# Altium schematic sheet RS485.SchDoc
size A; SheetNumber: 10; SheetTotal: 13
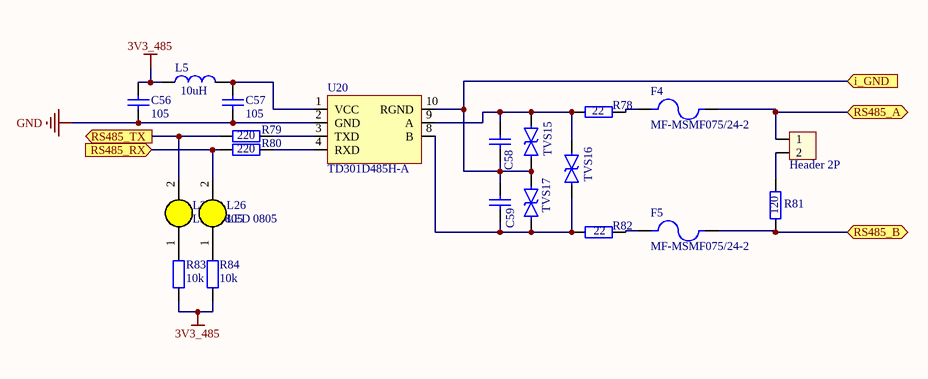
[diagram p0: RS485.SchDoc]

## Parts
C56  105  [0603_Cap]
C57  105  [0603_Cap]
C58  101  [0603_Cap]  (value not drawn)
C59  101  [0603_Cap]  (value not drawn)
F4  MF-MSMF075/24-2  [FUSER_MF-MSMF075/24-2]
F5  MF-MSMF075/24-2  [FUSER_MF-MSMF075/24-2]
H24  Header 2P  [JP 1x2]
L5  10uH  [0603_Inductor]
L25  LED 0805  [LED-0805-Yellow]
L26  LED 0805  [LED-0805-Yellow]
R78  22  [0603_Res]
R79  220  [0603_Res]
R80  220  [0603_Res]
R81  120  [0603_Res]
R82  22  [0603_Res]
R83  10k  [0603_Res]
R84  10k  [0603_Res]
TVS15  SMBJ12CA  [SMB - DO-214AA]  (value not drawn)
TVS16  SMBJ12CA  [SMB - DO-214AA]  (value not drawn)
TVS17  SMBJ12CA  [SMB - DO-214AA]  (value not drawn)
U20  TD301D485H-A  [TD301D485H-A]

## Ports
i_GND (in), RS485_A (bidir), RS485_B (bidir), RS485_RX (in), RS485_TX (out)

## Nets
3V3_485: C56.1 L5.1 R83.2 R84.2
GND: C56.2 C57.2 U20.2(GND)
i_GND: C58.2 C59.1 TVS15.1 TVS17.2 U20.10(RGND) ; port i_GND
RS485_A: F4.2 H24.1 ; port RS485_A
RS485_B: F5.2 R81.2 ; port RS485_B
RS485_RX: L26.2(K) R80.1 ; port RS485_RX
RS485_TX: L25.2(K) R79.1 ; port RS485_TX
NetC57_1: C57.1 L5.2 U20.1(VCC)
NetC58_1: C58.1 R78.2 TVS15.2 TVS16.2 U20.9(A)
NetC59_2: C59.2 R82.2 TVS16.1 TVS17.1 U20.8(B)
NetF4_1: F4.1 R78.1
NetF5_1: F5.1 R82.1
NetH24_2: H24.2 R81.1
NetL25_1: L25.1(A) R83.1
NetL26_1: L26.1(A) R84.1
NetR79_2: R79.2 U20.3(TXD)
NetR80_2: R80.2 U20.4(RXD)

## Library data of the parts
C56-C59 = Ceramic Capacitor: Chung_Loai: Dán; Don_Vi: Con; So_Chan: 2; Ten_Linh_Kien: Tụ 0805 104-100nF 10% 50V; Ma_Hang: MH004551; Kieu_Chan: *
F4 F5 = MF-MSMF075/24-2: Polymeric PTC Resettable Fuse 24V 750 mA Ih Surface Mount 1812 (4532 Metric), Concave; MF: Bourns; Value: *; Check_prices: https://www.snapeda.com/parts/MF-MSMF075/24-2/Bourns/view-part/?ref=eda; Availability: In Stock; Price: None; MP: MF-MSMF075/24-2; Package: 1812 Bourns; SnapEDA_Link: https://www.snapeda.com/parts/MF-MSMF075/24-2/Bourns/view-part/?ref=snap; Purchase-URL: https://pricing.snapeda.com/search/part/MF-MSMF075/24-2/?ref=eda
H24 = Header 2P: THT; Ten_Linh_Kien: Header 2P XH2.54-2P Đực Cong; Don_Vi: Con; Ma_Hang: MH002852; Chung_Loai: Cắm
L5 = Inductor: Inductors from EPCOS include SMT Inductors, SMT Power Inductors, Transponder Coils, ISDN Transformers, xDSL Transformers, DC/DC Converters, RF Transformers and SMT Current Sense Transformers.; MP: B82477G4472M000; Price: None; SnapEDA_Link: https://www.snapeda.com/parts/B82477G4472M000/EPCOS/view-part/?ref=snap; Package: NON STANDARD-2 EPCOS; Value: *; Check_prices: https://www.snapeda.com/parts/B82477G4472M000/EPCOS/view-part/?ref=eda; Availability: In Stock; MF: EPCOS; Purchase-URL: https://pricing.snapeda.com/search/part/B82477G4472M000/?ref=eda
L25 L26 = LED 0805 Vang: Dán; Don_Vi: Con; Ma_Hang: MH002329; Ten_Linh_Kien: LED 0805 Màu Vàng ( Yellow); Ghi_Chu: *; Kieu_Chan: *; Chung_Loai: Dán
R78-R84 = Resistor: Chung_Loai: Dán; Don_Vi: Con; So_Chan: 2; Ten_Linh_Kien: Trở 0805 1% 1k; Ma_Hang: MH005468; Kieu_Chan: *
TVS15-TVS17 = TVS Bi Diode
U20 = TD301D485H-A: TTL to RS485